# EAGLE design volume (EAGLE 9.4.2)
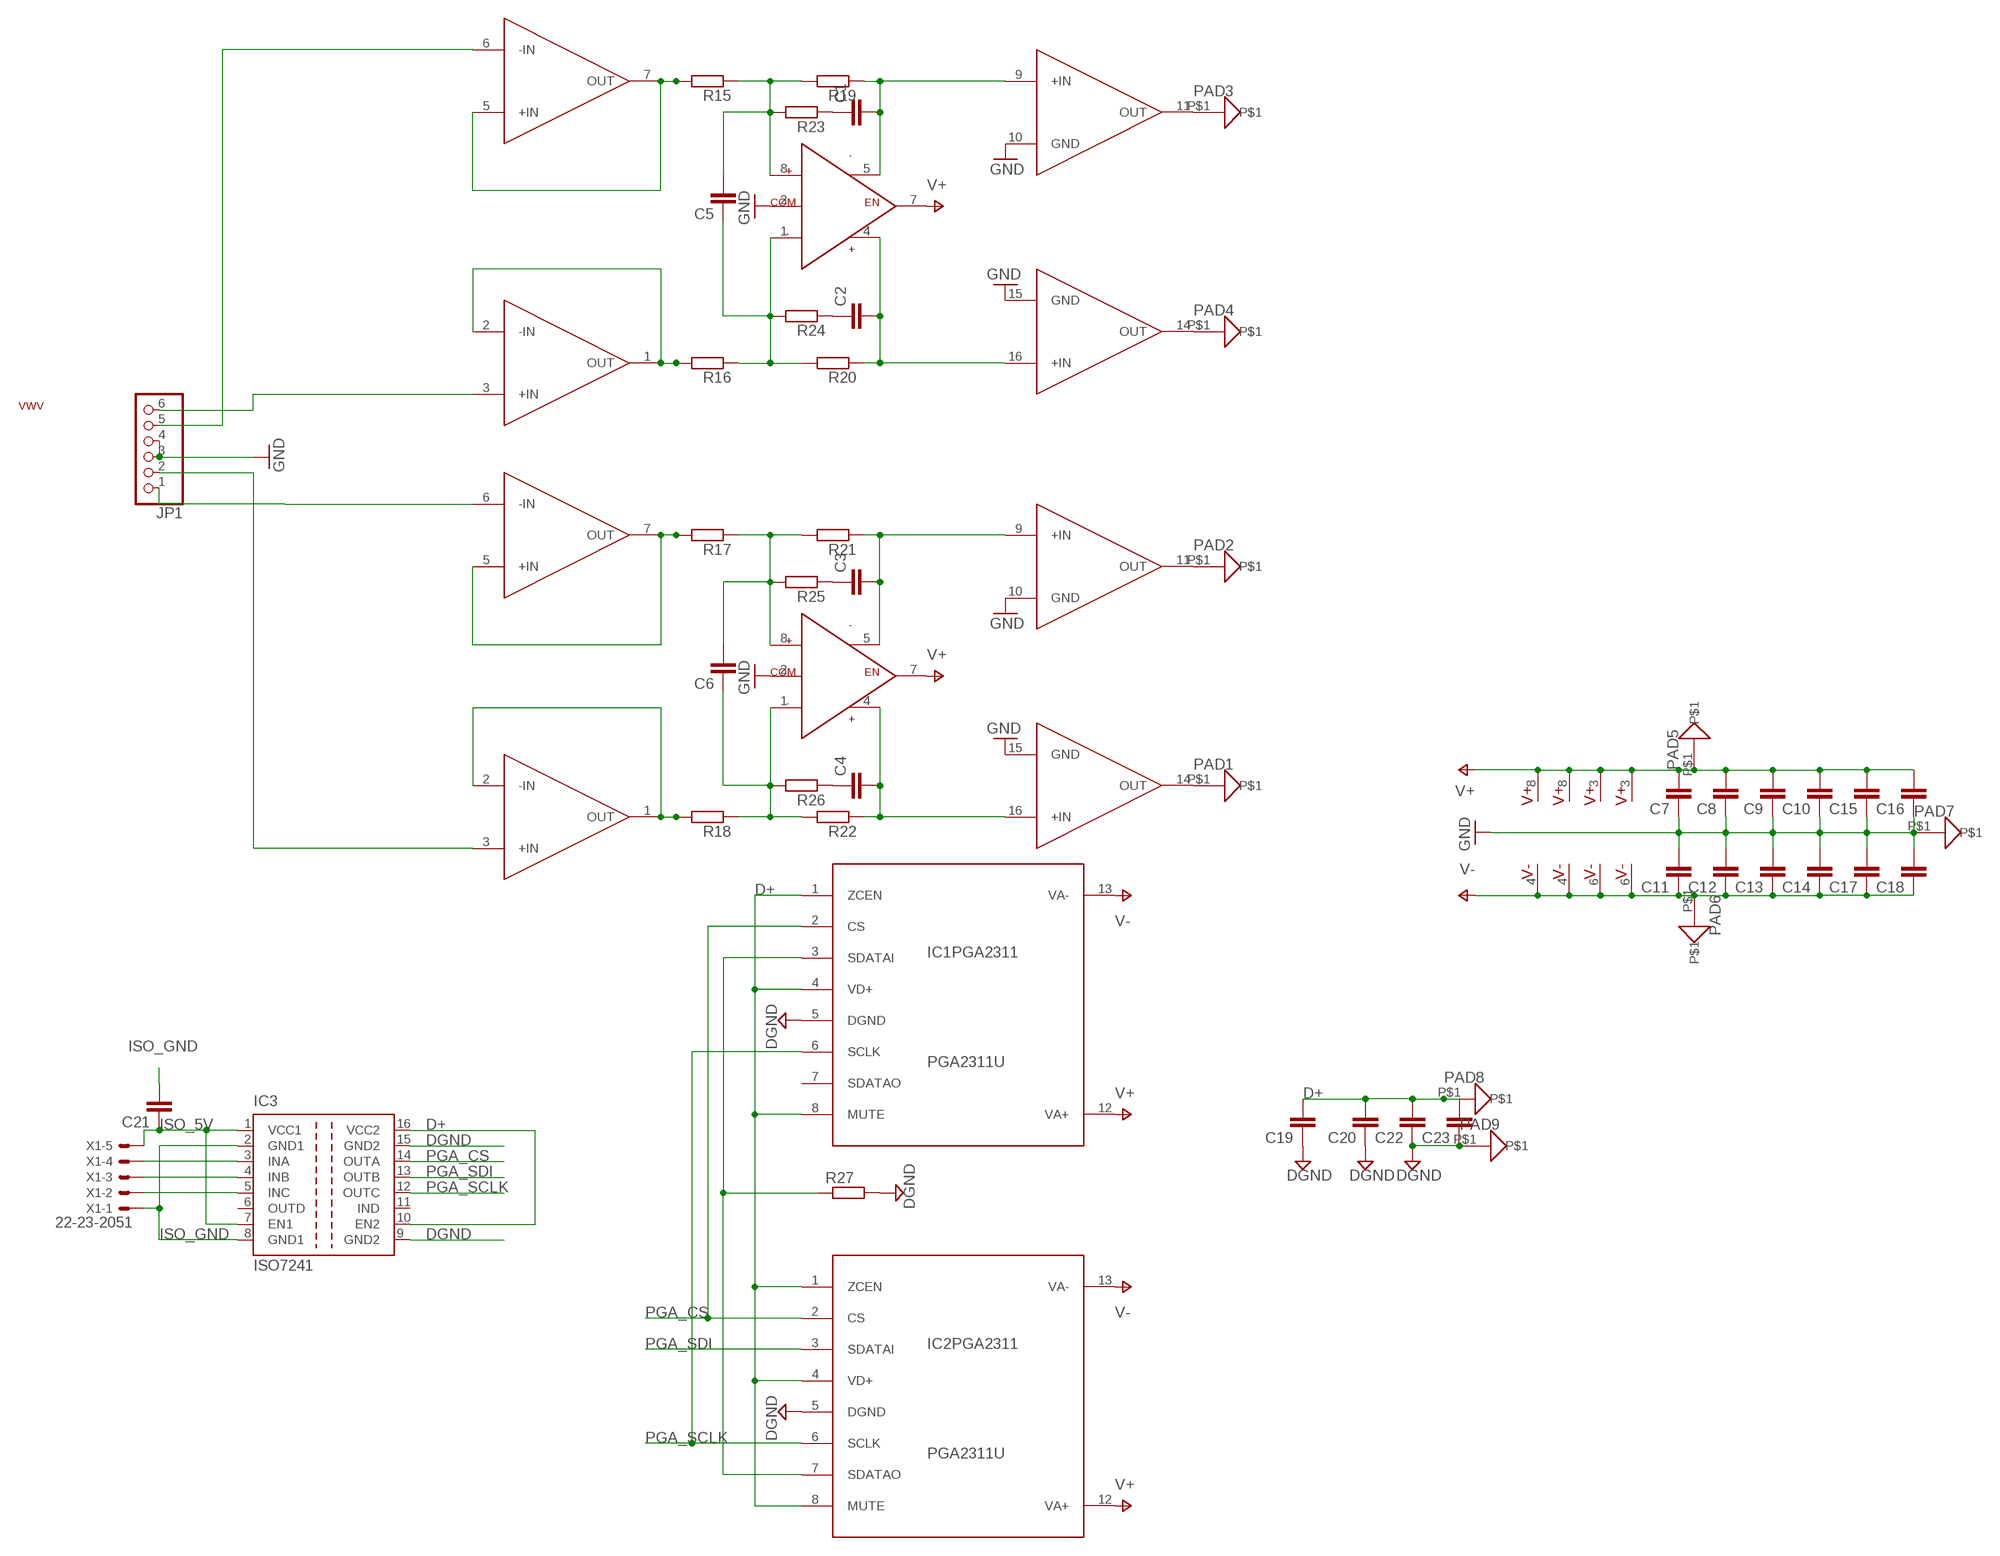
[diagram p0: schematic, sheet 1]

## Parts
C1  C-EUC0805  [C0805]
C2  C-EUC0805  [C0805]
C3  C-EUC0805  [C0805]
C4  C-EUC0805  [C0805]
C5  C-EUC0805  [C0805]
C6  C-EUC0805  [C0805]
C7  C-EUC0805  [C0805]
C8  C-EUC0805  [C0805]
C9  C-EUC0805  [C0805]
C10  C-EUC0805  [C0805]
C11  C-EUC0805  [C0805]
C12  C-EUC0805  [C0805]
C13  C-EUC0805  [C0805]
C14  C-EUC0805  [C0805]
C15  C-EUC0805  [C0805]
C16  C-EUC0805  [C0805]
C17  C-EUC0805  [C0805]
C18  C-EUC0805  [C0805]
C19  C-EUC0805  [C0805]
C20  C-EUC0805  [C0805]
C21  C-EUC0805  [C0805]
C22  C-EUC0805  [C0805]
C23  C-EUC0805  [C0805]
IC1  PGA2311U  [SO16-1]
IC2  PGA2311U  [SO16-1]
IC3  ISO7241  [SO-16DW]
JP1  PINHD-1X6  [1X06]
PAD1  PAD8  [PAD-8]
PAD2  PAD8  [PAD-8]
PAD3  PAD8  [PAD-8]
PAD4  PAD8  [PAD-8]
PAD5  PAD8  [PAD-8]
PAD6  PAD8  [PAD-8]
PAD7  PAD8  [PAD-8]
PAD8  PAD8  [PAD-8]
PAD9  PAD8  [PAD-8]
R15  R-EU_MELF0204W  [MINI_MELF-0204W]
R16  R-EU_MELF0204W  [MINI_MELF-0204W]
R17  R-EU_MELF0204W  [MINI_MELF-0204W]
R18  R-EU_MELF0204W  [MINI_MELF-0204W]
R19  R-EU_MELF0204W  [MINI_MELF-0204W]
R20  R-EU_MELF0204W  [MINI_MELF-0204W]
R21  R-EU_MELF0204W  [MINI_MELF-0204W]
R22  R-EU_MELF0204W  [MINI_MELF-0204W]
R23  R-EU_MELF0204W  [MINI_MELF-0204W]
R24  R-EU_MELF0204W  [MINI_MELF-0204W]
R25  R-EU_MELF0204W  [MINI_MELF-0204W]
R26  R-EU_MELF0204W  [MINI_MELF-0204W]
R27  R-EU_MELF0204W  [MINI_MELF-0204W]
S1  VWV  [VWV]
U$1  OPA1632  [SO8]
U$2  OPA1632  [SO8]
U$3  OP_DUALSOIC-8  [SOIC8]
U$4  OP_DUALSOIC-8  [SOIC8]
X1  22-23-2051  [22-23-2051]

## Nets
D+: C19.2 C20.2 C22.2 C23.2 IC1.1(PGA2311:ZCEN) IC1.4(PGA2311:VD+) IC1.8(PGA2311:MUTE) IC2.1(PGA2311:ZCEN) IC2.4(PGA2311:VD+) IC2.8(PGA2311:MUTE) IC3.10(EN2) IC3.16(VCC2) PAD8.P$1
DGND: C19.1 C20.1 C22.1 C23.1 IC1.5(PGA2311:DGND) IC2.5(PGA2311:DGND) IC3.9(GND2) IC3.15(GND2) PAD9.P$1 R27.2
GND: C7.1 C8.1 C9.1 C10.1 C11.2 C12.2 C13.2 C14.2 C15.1 C16.1 C17.2 C18.2 IC1.10(GND) IC1.15(GND) IC2.10(GND) IC2.15(GND) JP1.3 JP1.4 PAD7.P$1 U$1.2(COM) U$2.2(COM)
ISO_5V: C21.1 IC3.1(VCC1) IC3.7(EN1) X1.5
ISO_GND: C21.2 IC3.2(GND1) IC3.8(GND1) X1.1
N$1: JP1.6 U$3.3(+IN)
N$3: JP1.5 U$3.6(-IN)
N$4: JP1.2 U$4.3(+IN)
N$6: JP1.1 U$4.6(-IN)
N$8: R16.2 U$3.1(OUT) U$3.2(-IN)
N$10: R15.2 U$3.5(+IN) U$3.7(OUT)
N$12: R18.2 U$4.1(OUT) U$4.2(-IN)
N$14: R17.2 U$4.5(+IN) U$4.7(OUT)
N$15: C5.1 R16.1 R20.2 R24.2 U$1.1(IN-)
N$16: C5.2 R15.1 R19.2 R23.2 U$1.8(IN+)
N$17: C6.2 R17.1 R21.2 R25.2 U$2.8(IN+)
N$18: C6.1 R18.1 R22.2 R26.2 U$2.1(IN-)
N$19: C1.2 IC1.9(+IN) R19.1 U$1.5(OUT-)
N$20: C2.2 IC1.16(+IN) R20.1 U$1.4(OUT+)
N$21: C3.2 IC2.9(+IN) R21.1 U$2.5(OUT-)
N$22: C4.2 IC2.16(+IN) R22.1 U$2.4(OUT+)
N$23: C1.1 R23.1
N$24: C2.1 R24.1
N$25: C3.1 R25.1
N$26: C4.1 R26.1
N$29: IC3.3(INA) X1.4
N$30: IC1.3(PGA2311:SDATAI) IC2.7(PGA2311:SDATAO) R27.1
N$31: IC3.4(INB) X1.3
N$32: IC3.5(INC) X1.2
N$33: IC2.14(OUT) PAD1.P$1
N$34: IC2.11(OUT) PAD2.P$1
N$35: IC1.11(OUT) PAD3.P$1
N$36: IC1.14(OUT) PAD4.P$1
PGA_CS: IC1.2(PGA2311:CS) IC2.2(PGA2311:CS) IC3.14(OUTA)
PGA_SCLK: IC1.6(PGA2311:SCLK) IC2.6(PGA2311:SCLK) IC3.12(OUTC)
PGA_SDI: IC2.3(PGA2311:SDATAI) IC3.13(OUTB)
V+: C7.2 C8.2 C9.2 C10.2 C15.2 C16.2 IC1.12(PGA2311:VA+) IC2.12(PGA2311:VA+) PAD5.P$1 U$1.3(V+) U$1.7(EN) U$2.3(V+) U$2.7(EN) U$3.8(V+) U$4.8(V+)
V-: C11.1 C12.1 C13.1 C14.1 C17.1 C18.1 IC1.13(PGA2311:VA-) IC2.13(PGA2311:VA-) PAD6.P$1 U$1.6(V-) U$2.6(V-) U$3.4(V-) U$4.4(V-)
Unconnected: IC1.7(PGA2311:SDATAO) IC3.6(OUTD) IC3.11(IND)

## Library data of the parts
C1-C23 = Vwvwbg:C-EU: CAPACITOR, European symbol
IC1 IC2 = Vwvwbg:PGA2311
IC3 = Vwvwbg:ISO7241: HIGH SPEED QUAD DIGITAL ISOLATORS Source: http://focus.ti.com/lit/ds/symlink/iso7240m.pdf; MPN: ISO7241CDW; OC_FARNELL: 1575372; OC_NEWARK: 73M3155
JP1 = Vwvwbg:PINHD-1X6: PIN HEADER
PAD1-PAD9 = Vwvwbg:PAD
R15-R27 = Vwvwbg:R-EU_: RESISTOR, European symbol
S1 = Vwvwbg:VWV
U$1 U$2 = Vwvwbg:OPA1632
U$3 U$4 = Vwvwbg:OP_DUAL
X1 = con-molex:22-23-2051: .100" (2.54mm) Center Header - 5 Pin; MF: MOLEX; MPN: 22-23-2051; OC_FARNELL: 1462952; OC_NEWARK: 38C9178

## Board
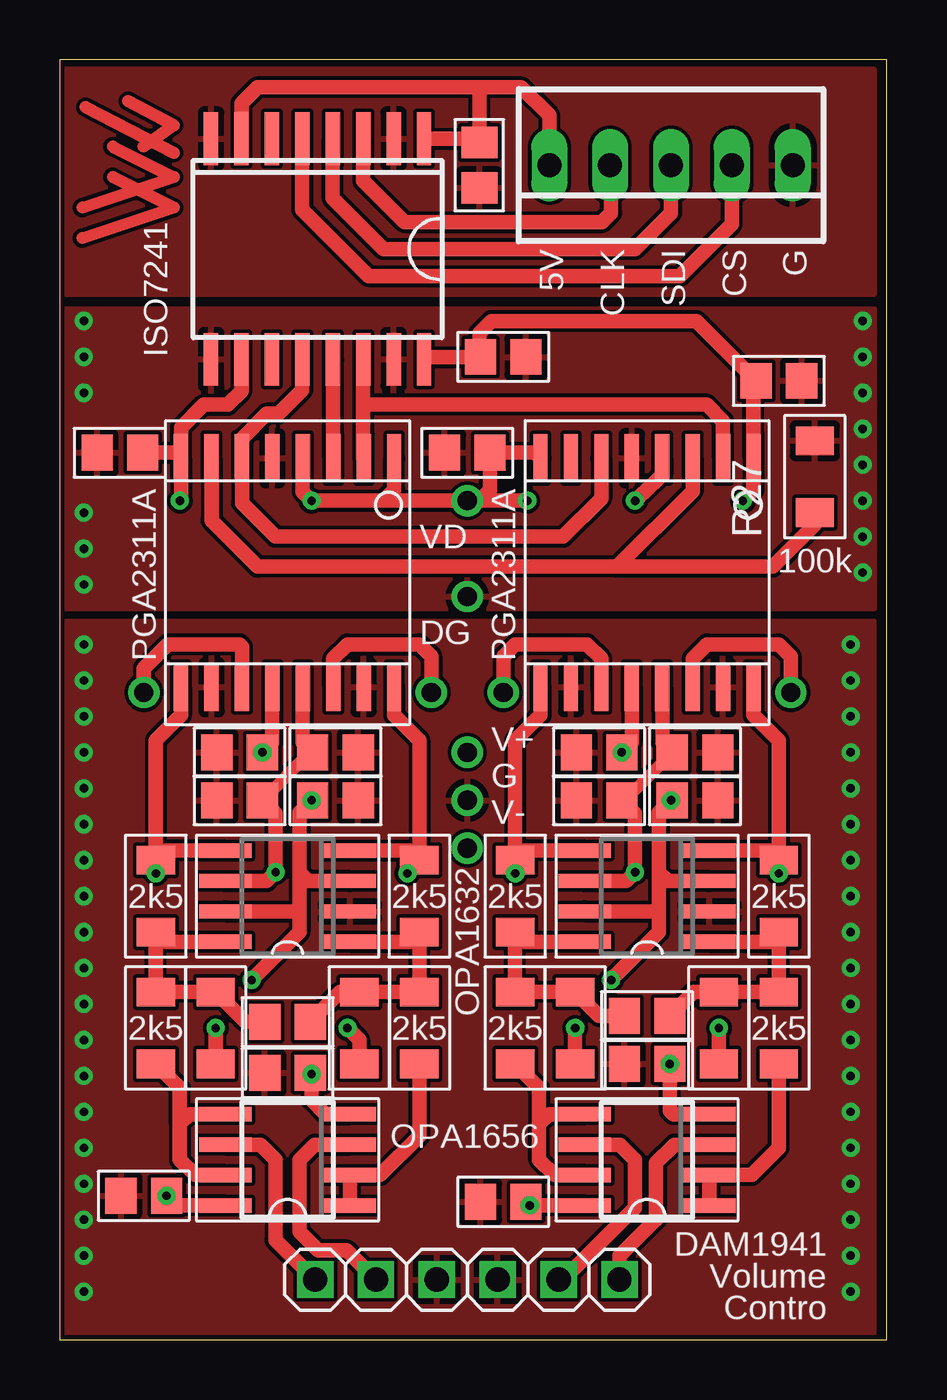
[diagram p1: board, top side]
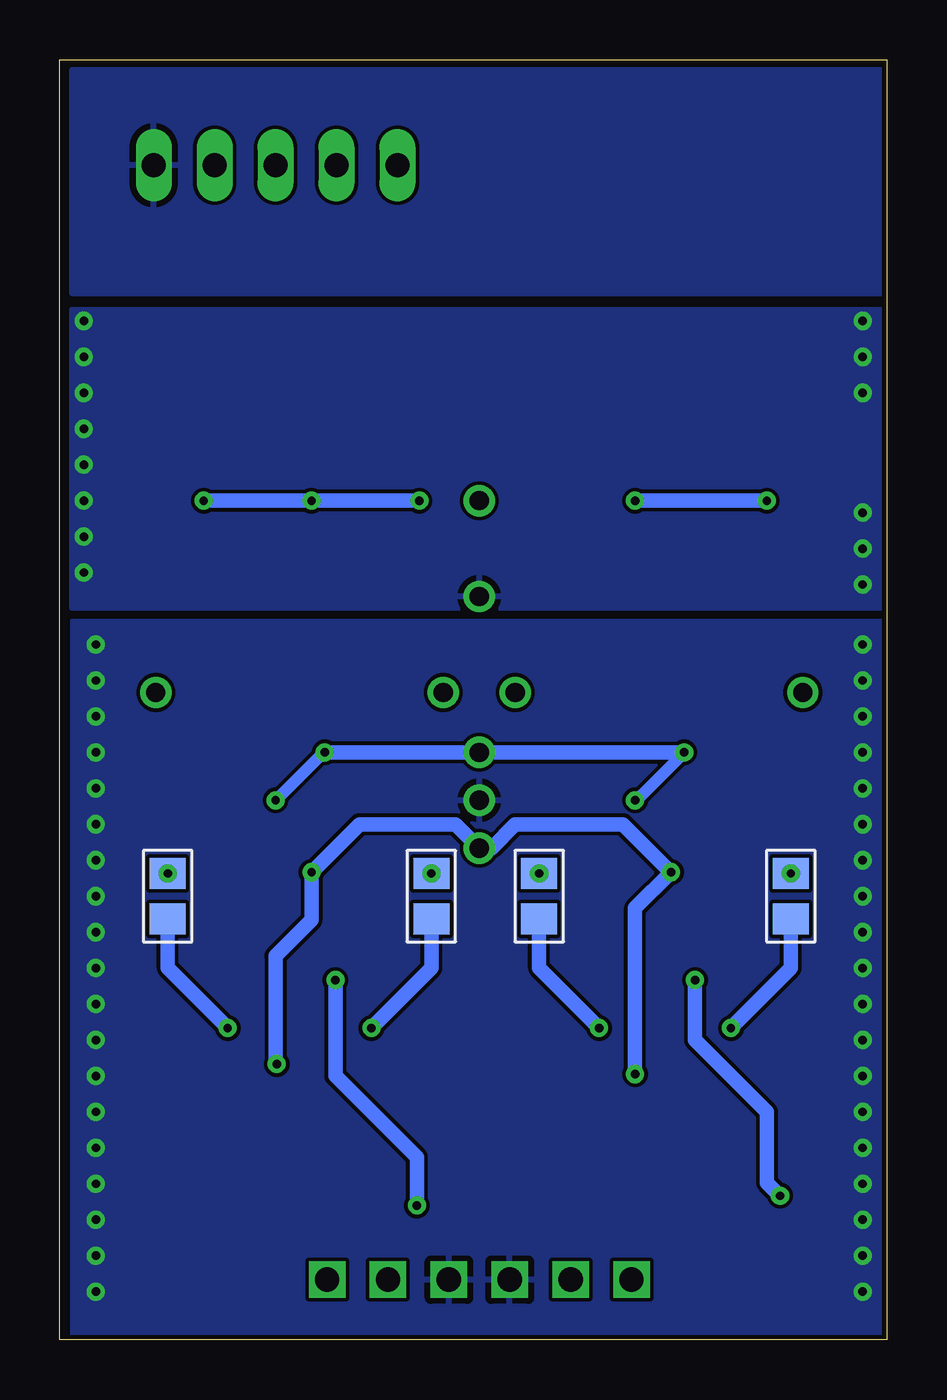
[diagram p2: board, bottom side, seen from below]

Size 34.5 x 53.39 mm. Coordinates in mm from the lower left corner, seen from the top.
Outline: 0,0 34.5,0 34.5,53.39 0,53.39 0,0
Copper layers (1*16): Top 0.035mm / dielectric 0.15mm / Bottom 0.035mm
Design rules "default *": minimum track width 6mil, minimum drill 0.35mm, track to track 6mil, track to pad 6mil, pad to pad 6mil, via to via 6mil, smd to smd 0mil, copper to edge 8mil, drill to drill 6mil, minimum pad ring 10mil, minimum via ring 8mil, stop-mask expansion 4mil, vias tented up to drill 0mil, thermal gap 10mil

### Footprints (pad centres in the part's own frame; a part is rotated, then mirrored left to right if it is on the bottom)
C0805 = smd 1.3 x 1.5: 1 -0.95,0; 2 0.95,0
SO16-1 = smd 0.6 x 2: 1 -4.445,-4.775; 2 -3.175,-4.775; 3 -1.905,-4.775; 4 -0.635,-4.775; 5 0.635,-4.775; 6 1.905,-4.775; 7 3.175,-4.775; 8 4.445,-4.775; 9 4.445,4.775; 10 3.175,4.775; 11 1.905,4.775; 12 0.635,4.775; 13 -0.635,4.775; 14 -1.905,4.775; 15 -3.175,4.775; 16 -4.445,4.775
SO-16DW = smd 0.6 x 2.2: 1 -4.445,-4.6; 2 -3.175,-4.6; 3 -1.905,-4.6; 4 -0.635,-4.6; 5 0.635,-4.6; 6 1.905,-4.6; 7 3.175,-4.6; 8 4.445,-4.6; 9 4.445,4.6; 10 3.175,4.6; 11 1.905,4.6; 12 0.635,4.6; 13 -0.635,4.6; 14 -1.905,4.6; 15 -3.175,4.6; 16 -4.445,4.6
1X06 = drill 1.016 square: 1 -6.35,0; 2 -3.81,0; 3 -1.27,0; 4 1.27,0; 5 3.81,0; 6 6.35,0
PAD-8 = drill 0.8: P$1 0,0
MINI_MELF-0204W = smd 1.2 x 1.6: 1 -1.5,0; 2 1.5,0
SO8 = smd 0.6 x 2.2: 1 -1.905,-2.6; 2 -0.635,-2.6; 3 0.635,-2.6; 4 1.905,-2.6; 5 1.905,2.6; 6 0.635,2.6; 7 -0.635,2.6; 8 -1.905,2.6
SOIC8 = smd 0.6 x 2.2: 1 -1.905,-2.6; 2 -0.635,-2.6; 3 0.635,-2.6; 4 1.905,-2.6; 5 1.905,2.6; 6 0.635,2.6; 7 -0.635,2.6; 8 -1.905,2.6
22-23-2051 = drill 1 long: 1 -5.08,0; 2 -2.54,0; 3 0,0; 4 2.54,0; 5 5.08,0

### Placement (x,y rotation side)
C1  19,18.5 90 bottom
C2  30,18.5 90 bottom
C3  4,18.5 90 bottom
C4  14.5,18.5 90 bottom
C5  24.5,13.5 180 top
C6  9.5,13.25 180 top
C7  11.5,22.5 180 top
C8  26.5,22.5 180 top
C9  3.5,6 0 top
C10  18.5,5.75 0 top
C11  7.5,22.5 180 top
C12  22.5,22.5 180 top
C13  24.5,11.5 180 top
C14  9.5,11.12 180 top
C15  7.5,24.5 0 top
C16  22.5,24.5 0 top
C17  26.5,24.5 0 top
C18  11.5,24.5 0 top
C19  2.5,37 0 top
C20  17,37 0 top
C21  17.5,49 270 top
C22  18.5,41 180 top
C23  30,40 180 top
IC1  24.5,32 180 top
IC2  9.5,32 180 top
IC3  10.75,45.5 180 top
JP1  17,2.5 0 top
PAD1  15.5,27 0 top
PAD2  3.5,27 0 top
PAD3  18.5,27 0 top
PAD4  30.5,27 0 top
PAD5  17,24.5 0 top
PAD6  17,20.5 0 top
PAD7  17,22.5 0 top
PAD8  17,35 0 top
PAD9  17,31 0 top
R15  19,13 270 top
R16  30,13 270 top
R17  4,13 270 top
R18  15,13 270 top
R19  19,18.5 270 top
R20  30,18.5 270 top
R21  4,18.5 270 top
R22  15,18.5 270 top
R23  21.5,13 90 top
R24  27.5,13 90 top
R25  6.5,13 90 top
R26  12.5,13 90 top
R27  31.5,36 90 top
S1  4.75,48.5 90 top
U$1  24.5,18.5 90 top
U$2  9.5,18.5 90 top
U$3  24.5,7.5 90 top
U$4  9.5,7.5 90 top
X1  25.5,49 180 top

### Tracks (layer width: path | path; a pad name or v marks a point on that pad's centre or on a via)
D+  (via drill 0.35)
  Top 0.61: IC2.8 5.05,35.05 v5,35 | C19.2 4.83,37 IC2.8 | IC1.8 19.83,37 C20.2 17.95,35.45 17.5,35 | IC2.4 10.13,35.36 v10.5,35 13.5,35 | 13.5,35 13.95,35.45 IC2.1 | 13.5,35 PAD8.P$1 17.5,35 | 17.5,35 v19.5,35 | v24,35 24.32,35.32 24.35,35.32 25.14,36.1 IC1.4 | v28.5,35 28.95,35.45 IC1.1 28.95,39.51 C23.2 26.55,42.5 18,42.5 17.5,42 17.5,41.05 C22.2 15.3,41 IC3.16 | IC2.8 5.05,38.05 6,39 7,39 7.57,39.58 IC3.10
  Bottom 0.61: v19.5,35 v24,35 v28.5,35 | v5,35 v10.5,35
DGND  (via drill 0.35)
  other vias: 1,42.5 1,41 1,39.5 1,34.5 1,33 1,31.5 33.5,42.5 33.5,41 33.5,39.5 33.5,38 33.5,36.5 33.5,35 33.5,33.5 33.5,32
  pour Top: -1,30.5 34,30.5 34,43 -1,43
  pour Bottom: -1,30.5 34,30.5 34,43 -1,43
GND  (via drill 0.35)
  other vias: 1,29 1,27.5 1,26 1,24.5 1,23 1,21.5 1,20 1,18.5 1,17 1,15.5 1,14 1,12.5 1,11 1,9.5 1,8 1,6.5 1,5 1,3.5 1,2 33,29 33,27.5 33,26 33,24.5 33,23 33,21.5 33,20 33,18.5 33,17 33,15.5 33,14 33,12.5 33,11 33,9.5 33,8 33,6.5 33,5 33,3.5 33,2
  pour Top: -1,30 34,30 34,0 -1,0
  pour Bottom: -1,30 34,30 34,0 -1,0
ISO_5V
  Top 0.61: IC3.7 7.57,51.58 8.25,52.25 17.5,52.25 | X1.5 20.42,51.08 19.25,52.25 17.5,52.25 | 17.5,52.25 C21.1 17.35,50.1 IC3.1
ISO_GND
  pour Top: -1,43.62 34,43.62 34,53 -1,53
  pour Bottom: -1,43.62 34,43.62 34,53 -1,53
N$1
  Top 0.61: U$3.3 25.64,8.13 24.88,7.38 24.88,5 24.85,5 23.35,3.5 JP1.6
N$3
  Top 0.61: U$3.6 23.36,8.13 24,7.5 24,5.5 21,2.5 JP1.5
N$4
  Top 0.61: U$4.3 10.63,8.13 10,7.5 10,4.5 10.78,3.72 11.97,3.72 JP1.2
N$6
  Top 0.61: U$4.6 8.37,8.13 9,7.5 9,4.15 JP1.1
N$8
  Top 0.61: U$3.1 U$3.2 28.86,6.87 30,8 R16.2
N$10
  Top 0.61: U$3.7 20.64,6.87 20,7.5 20,9 | 20,9 20.41,9.41 U$3.5 | R15.2 20,10.5 20,9
N$12
  Top 0.61: U$4.1 U$4.2 13.37,6.87 15,8.5 R18.2
N$14
  Top 0.61: U$4.7 5.63,6.87 5,7.5 5,9 | U$4.5 5.41,9.41 5,9 | R17.2 5,10.5 5,9
N$15
  Top 0.61: C5.1 26.45,14.5 R24.2 R16.1 R20.2 29.59,16.59 U$1.1
N$16
  Top 0.61: U$1.8 19.41,16.59 R19.2 R15.1 R23.2 22.5,13.5 C5.2
N$17
  Top 0.61: U$2.8 4.41,16.59 R21.2 R17.1 R25.2 7.75,13.25 C6.2
N$18
  Top 0.61: U$2.1 14.6,16.59 R22.2 R18.1 R26.2 11.7,14.5 C6.1
N$19  (via drill 0.35)
  Top 0.61: U$1.5 19.41,20.41 R19.1 | IC1.9 20.05,26.05 19,25 R19.1 | C1.2 R19.1
  other vias: 19,19.45
N$20  (via drill 0.35)
  Top 0.61: U$1.4 29.59,20.41 R20.1 | IC1.16 28.95,26.05 30,25 R20.1 | C2.2 R20.1
  other vias: 30,19.45
N$21  (via drill 0.35)
  Top 0.61: U$2.5 4.41,20.41 R21.1 | IC2.9 5.05,26.05 4,25 R21.1 | C3.2 R21.1
  other vias: 4,19.45
N$22  (via drill 0.35)
  Top 0.61: U$2.4 14.6,20.41 R22.1 | IC2.16 13.95,26.05 15,25 R22.1 | R22.1 15,19.95 C4.2
  other vias: 14.5,19.45
N$23  (via drill 0.35)
  Top 0.61: R23.1 v21.5,13
  Bottom 0.61: v21.5,13 19,15.5 C1.1
N$24  (via drill 0.35)
  Top 0.61: R24.1 v27.5,13
  Bottom 0.61: v27.5,13 30,15.5 C2.1
N$25  (via drill 0.35)
  Top 0.61: R25.1 v6.5,13
  Bottom 0.61: v6.5,13 4,15.5 C3.1
N$26  (via drill 0.35)
  Top 0.61: R26.1 12.5,12.5 v12,13
  Bottom 0.61: v12,13 14.5,15.5 C4.1
N$29
  Top 0.61: IC3.3 12.65,48.34 14.38,46.62 22.62,46.62 23,47 23,48.96 X1.4
N$30
  Top 0.61: IC1.3 26.41,35.41 23.25,32.25 | IC2.7 6.33,34.17 8.25,32.25 23.25,32.25 | 23.25,32.25 29.75,32.25 31.5,34 R27.1
N$31
  Top 0.61: X1.3 25.5,47 24,45.5 13.5,45.5 11.38,47.62 IC3.4
N$32
  Top 0.61: IC3.5 10.12,47.13 12.88,44.38 25.88,44.38 28.04,46.54 X1.2
N$33
  Top 0.61: IC2.14 11.4,28.41 12,29 15,29 15.5,28.5 PAD1.P$1
N$34
  Top 0.61: IC2.11 7.6,28.91 7.5,29 4.5,29 3.5,28 PAD2.P$1
N$35
  Top 0.61: IC1.11 22.59,28.41 22,29 19,29 18.5,28.5 PAD3.P$1
N$36
  Top 0.61: IC1.14 26.41,28.41 27,29 30,29 30.5,28.5 PAD4.P$1
PGA_CS
  Top 0.61: IC3.14 12.65,39 | 12.65,39 12.65,36.8 IC2.2 | IC1.2 27.68,38.33 27,39 12.65,39
PGA_SCLK
  Top 0.61: IC1.6 22.59,35.09 21,33.5 9,33.5 7.6,34.91 IC2.6 7.6,37.59 8.62,38.62 9.12,38.62 10.12,39.62 IC3.12
PGA_SDI
  Top 0.61: IC2.3 11.4,40.88 IC3.13
V+  (via drill 0.35)
  Top 0.61: U$2.3 10.37,19.13 10,19.5 | 10,19.5 10,22 v10.5,22.5 C7.2 | U$1.3 25.36,19.13 25,19.5 | 25,19.5 25,22 v25.5,22.5 C8.2 | IC1.12 23.86,24.91 C16.2 | IC2.12 8.87,24.91 C15.2 | 10,19.5 10,18 | 10,18 10,17 v8,15 | 25,19.5 25,18 | 25,18 25,17 v23,15 | U$1.7 24.86,17.87 25,18 | U$2.7 9.87,17.87 10,18 | U$3.8 v19.61,5.59 C10.2 | U$4.8 4.86,5.59 C9.2
  Bottom 0.508: C15.2 10.45,22.5 v10.5,22.5 | C16.2 23.5,24.5 v25.5,22.5
  Bottom 0.61: v8,15 8,12.5 5,9.5 5,6.55 C9.2 | C15.2 PAD5.P$1 C16.2 | v19.61,5.59 19.61,7.61 23,11 v23,15
  other vias: 8.45,24.5 23.45,24.5 4.45,6
V-  (via drill 0.35)
  Top 0.508: C11.1 10.45,24.5 C18.1 | C17.1 23.55,22.5 C12.1
  Top 0.61: U$2.6 8.63,19.13 v9,19.5 9,21.95 C11.1 | U$1.6 23.64,19.13 v24,19.5 24,21.95 C12.1 | IC1.13 25.14,24.91 C17.1 | IC2.13 10.13,24.91 C18.1 | U$4.4 11.1,9.41 10.5,10 v10.5,11.07 C14.1 | U$3.4 25.59,9.41 25.45,9.55 C13.1
  Bottom 0.61: C13.1 25.5,11.55 25.5,16 24,17.5 v24,19.5 22,21.5 18,21.5 PAD6.P$1 16.5,20.5 15.5,21.5 11,21.5 v9,19.5 10.5,18 v10.5,11.07
  other vias: 25.45,11.5

### Text on the board
tPlace: 5V / CLK / SDI / CS / G | ISO7241 | PGA2311A | PGA2311A | VD | 100k | DG | V+ / G / V- | 2k5 | 2k5 | 2k5 | 2k5 | OPA1632 | 2k5 | 2k5 | 2k5 | 2k5 | OPA1656 | DAM1941 / Volume / Contro